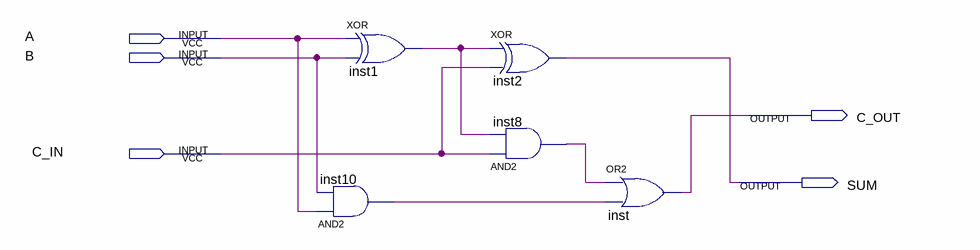
[diagram p0: schematic sheet]
// Quartus schematic lab42a.bdf as structural Verilog: 5 symbols, 5 pins
module lab42a (
  input  A,
  input  B,
  input  C_IN,
  output C_OUT,
  output SUM
);

  wire inst1_out, inst8_out, inst10_out;

  xor inst1 (inst1_out, A, B);
  and inst10 (inst10_out, A, B);
  xor inst2 (SUM, inst1_out, C_IN);
  and inst8 (inst8_out, C_IN, inst1_out);
  or inst (C_OUT, inst8_out, inst10_out);
endmodule
